# Altium schematic sheet AT91.SchDoc: Treetap 7C - Microprocessor
size A3; Author: Treetap Group; DrawnBy: Treetap Group; Revision: 1; SheetNumber: 2; SheetTotal: 7; PageSetup: Record=PageOptions|CenterHorizontal=True|CenterVertical=True|PrintScale=1.01|XCorrection=1.00|YCorrection=1.00|PrintKind=1|BorderSize=5000000|LeftOffset=0|BottomOffset=0|Orientation=2|PaperLength=1000|PaperWidth=1000|Scale=100|PaperSource=15|PrintQuality=600|MediaType=1|DitherType=10|PaperKind=A3|PrintScaleMode=1
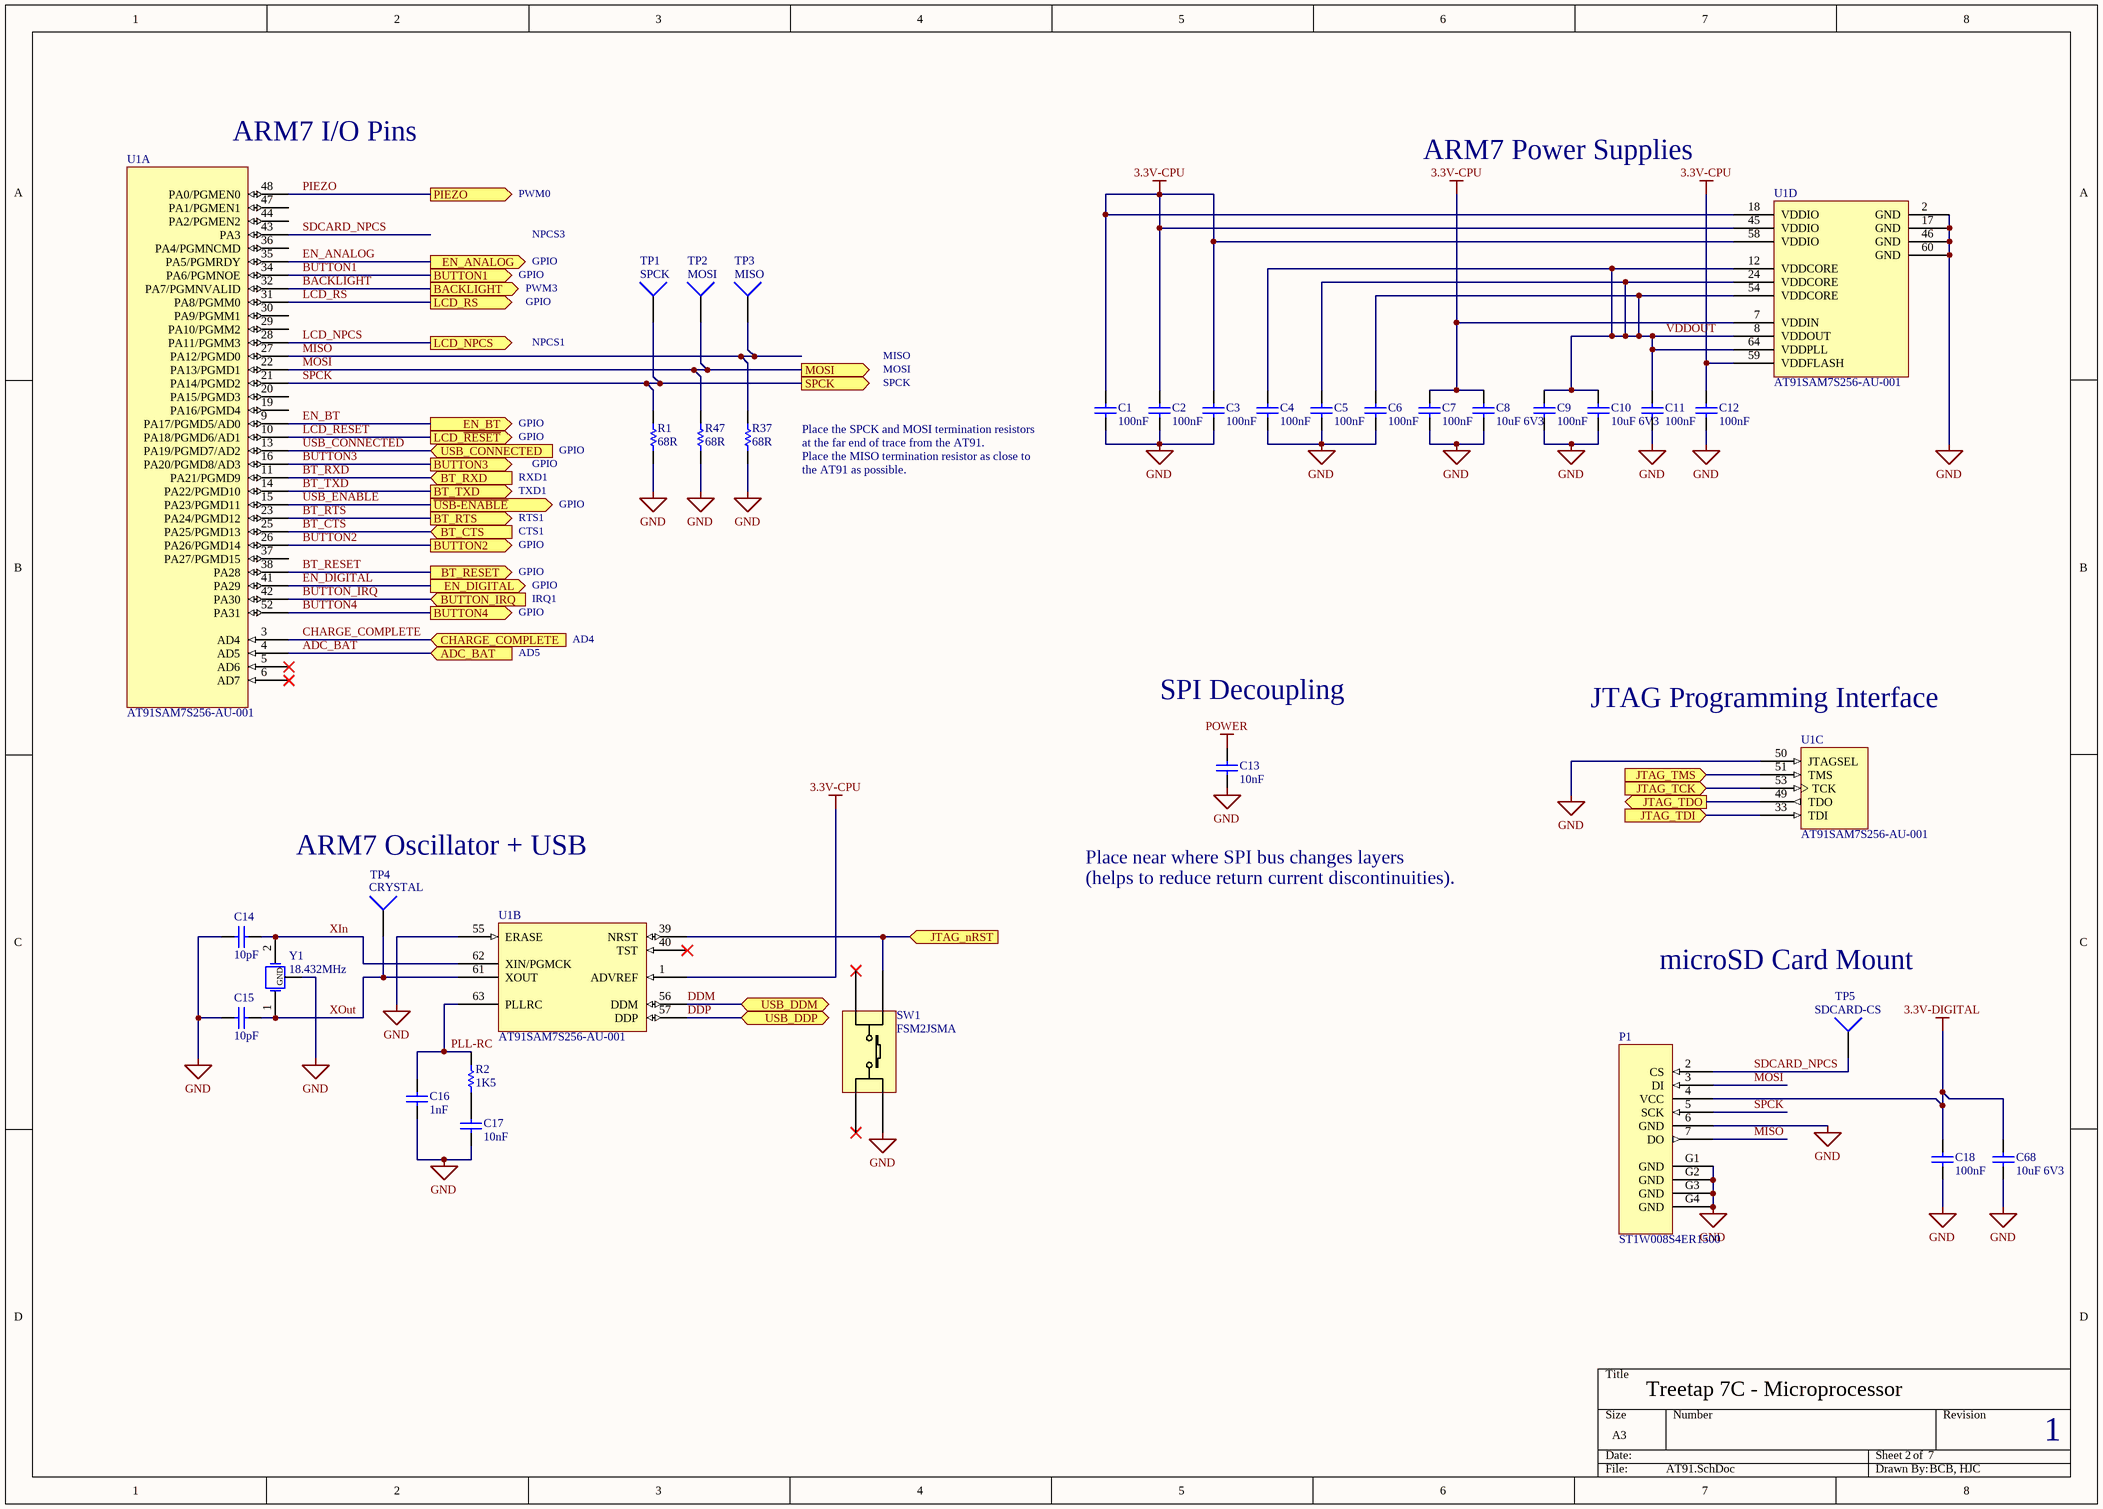
[diagram p0: AT91.SchDoc]

## Parts
C1  100nF  [CC0603]
C2  100nF  [CC0603]
C3  100nF  [CC0603]
C4  100nF  [CC0603]
C5  100nF  [CC0603]
C6  100nF  [CC0603]
C7  100nF  [CC0603]
C8  10uF 6V3  [CC0603]
C9  100nF  [CC0603]
C10  10uF 6V3  [CC0603]
C11  100nF  [CC0603]
C12  100nF  [CC0603]
C13  10nF  [CC0603]
C14  10pF  [CC0603]
C15  10pF  [CC0603]
C16  1nF  [CC0603]
C17  10nF  [CC0603]
C18  100nF  [CC0603]
C68  10uF 6V3  [CC0603]
P1  ST1W008S4ER1500  [ST1W008S4ER1500]
R1  68R  [R0603]
R2  1K5  [R0603]
R37  68R  [R0603]
R47  68R  [R0603]
SW1  FSM2JSMA  [FSM2JSMA]
TP1  SPCK  [SMTP_1]
TP2  MOSI  [SMTP_1]
TP3  MISO  [SMTP_1]
TP4  CRYSTAL  [SMTP_1]
TP5  SDCARD-CS  [SMTP_1]
U1  AT91SAM7S256-AU-001  [LQFP64_L]  (parts A,B,C,D of 4)
Y1  18.432MHz  [ABM10-18.432MHZ-E20-T]

## Ports
ADC_BAT (in), BACKLIGHT (out), BT_CTS (in), BT_RESET (out), BT_RTS (out), BT_RXD (in), BT_TXD (out), BUTTON1 (out), BUTTON2 (out), BUTTON3 (out), BUTTON4 (out), BUTTON_IRQ (in), CHARGE_COMPLETE (in), EN_ANALOG (out), EN_BT (out), EN_DIGITAL (out), JTAG_nRST (in), JTAG_TCK (in), JTAG_TDI (in), JTAG_TDO (out), JTAG_TMS (in), LCD_NPCS (out), LCD_RS (out), LCD_~{RESET} (out), MOSI (out), PIEZO (out), SPCK (out), USB_CONNECTED (in), USB_DDM (bidir), USB_DDP (bidir), ~{USB-ENABLE} (out)

## Nets
3.3V-CPU: C1.2 C2.2 C3.1 C7.1 C8.2 C12.2 U1.1(ADVREF) U1.7(VDDIN) U1.18(VDDIO) U1.45(VDDIO) U1.58(VDDIO) U1.59(VDDFLASH)
3.3V-DIGITAL: C18.2 C68.2 P1.4(VCC)
GND: C1.1 C2.1 C3.2 C4.1 C5.1 C6.1 C7.2 C8.1 C9.2 C10.1 C11.1 C12.1 C13.1 C14.2 C15.1 C16.1 C17.1 C18.1 C68.1 P1.6(GND) P1.G1(GND) P1.G2(GND) P1.G3(GND) P1.G4(GND) R1.1 R37.1 R47.1 SW1.4 U1.2(GND) U1.17(GND) U1.46(GND) U1.50(JTAGSEL) U1.55(ERASE) U1.60(GND) Y1.G(GND)
POWER: C13.2
ADC_BAT: U1.4(AD5) ; port ADC_BAT
BACKLIGHT: U1.32(PA7/PGMNVALID) ; port BACKLIGHT
BT_CTS: U1.25(PA25/PGMD13) ; port BT_CTS
BT_RESET: U1.38(PA28) ; port BT_RESET
BT_RTS: U1.23(PA24/PGMD12) ; port BT_RTS
BT_RXD: U1.11(PA21/PGMD9) ; port BT_RXD
BT_TXD: U1.14(PA22/PGMD10) ; port BT_TXD
BUTTON1: U1.34(PA6/PGMNOE) ; port BUTTON1
BUTTON2: U1.26(PA26/PGMD14) ; port BUTTON2
BUTTON3: U1.16(PA20/PGMD8/AD3) ; port BUTTON3
BUTTON4: U1.52(PA31) ; port BUTTON4
BUTTON_IRQ: U1.42(PA30) ; port BUTTON_IRQ
CHARGE_COMPLETE: U1.3(AD4) ; port CHARGE_COMPLETE
DDM: U1.56(DDM) ; port USB_DDM
DDP: U1.57(DDP) ; port USB_DDP
EN_ANALOG: U1.35(PA5/PGMRDY) ; port EN_ANALOG
EN_BT: U1.9(PA17/PGMD5/AD0) ; port EN_BT
EN_DIGITAL: U1.41(PA29) ; port EN_DIGITAL
JTAG_nRST: SW1.1 U1.39(NRST) ; port JTAG_nRST
JTAG_TCK: U1.53(TCK) ; port JTAG_TCK
JTAG_TDI: U1.33(TDI) ; port JTAG_TDI
JTAG_TDO: U1.49(TDO) ; port JTAG_TDO
JTAG_TMS: U1.51(TMS) ; port JTAG_TMS
LCD_NPCS: U1.28(PA11/PGMM3) ; port LCD_NPCS
LCD_RESET: U1.10(PA18/PGMD6/AD1) ; port LCD_~{RESET}
LCD_RS: U1.31(PA8/PGMM0) ; port LCD_RS
MISO: P1.7(DO) R37.2 TP3.1 U1.27(PA12/PGMD0)
MOSI: P1.3(DI) R47.2 TP2.1 U1.22(PA13/PGMD1) ; port MOSI
PIEZO: U1.48(PA0/PGMEN0) ; port PIEZO
PLL-RC: C16.2 R2.2 U1.63(PLLRC)
SDCARD_NPCS: P1.2(CS) TP5.1 U1.43(PA3)
SPCK: P1.5(SCK) R1.2 TP1.1 U1.21(PA14/PGMD2) ; port SPCK
USB_CONNECTED: U1.13(PA19/PGMD7/AD2) ; port USB_CONNECTED
USB_ENABLE: U1.15(PA23/PGMD11) ; port ~{USB-ENABLE}
VDDOUT: C4.2 C5.2 C6.2 C9.1 C10.2 C11.2 U1.8(VDDOUT) U1.12(VDDCORE) U1.24(VDDCORE) U1.54(VDDCORE) U1.64(VDDPLL)
XIn: C14.1 U1.62(XIN/PGMCK) Y1.2(OSC2)
XOut: C15.2 TP4.1 U1.61(XOUT) Y1.1(OSC1)
NetC17_2: C17.2 R2.1

Not connected (* = marked no-connect by the designer): SW1 2* 3*; U1 5(AD6)* 6(AD7)* 19(PA16/PGMD4) 20(PA15/PGMD3) 29(PA10/PGMM2) 30(PA9/PGMM1) 36(PA4/PGMNCMD) 37(PA27/PGMD15) 40(TST)* 44(PA2/PGMEN2) 47(PA1/PGMEN1)

## Notes on the sheet
- (near U1) ARM7 I/O Pins
- ARM7 Power Supplies
- PWM0
- NPCS3
- GPIO
- PWM3
- NPCS1
- MISO
- MOSI
- (near C1) Place the SPCK and MOSI termination resistors
- at the far end of trace from the AT91.
- SPCK
- RXD1
- TXD1
- Place the MISO termination resistor as close to
- the AT91 as possible.
- CTS1
- RTS1
- IRQ1
- AD4
- AD5
- SPI Decoupling
- (near U1) JTAG Programming Interface
- ARM7 Oscillator + USB
- Place near where SPI bus changes layers
- (helps to reduce return current discontinuities).
- microSD Card Mount
- Treetap 7C - Microprocessor
- 2
- 7
- 1
- BCB, HJC

## Library data of the parts
C1-C7 C9 C11 C12 C18 = 100nF_CC0603: 0603 Capacitor; Supplier_Component_Code: RC-P100; published: 28/03/2007 10:54:57 a.m.; Supplier_Name: Soanar Plus; price: 0.09; value: 100nF; Part Number: 100nF_CC0603; Component Kind: Standard; Component Type: Standard; Designator: 100nF_CC0603; Pin Count: 2
C8 C10 C68 = 10uF_CC0603_6V3: 10uF 6.3V 0603 ceramic capacitor; Manufacturer: Multicomp; Part Number: MCCA000517; Supplier_Component_Code: 1759393; published: 8/06/2010; Supplier_Name: Farnell; price: 0.218; value: 10uF 6V3
C13 C17 = 10nF_CC0603: 0603 Capacitor; Supplier_Component_Code: RC-P097; published: 28/03/2007 10:54:57 a.m.; Supplier_Name: Soanar Plus; price: 0.09; value: 10nF; Part Number: 10nF_CC0603; Component Kind: Standard; Component Type: Standard; Designator: 10nF_CC0603; Pin Count: 2
C14 C15 = 10pF_CC0603: 0603 Capacitor; Supplier_Component_Code: RC-P050; published: 28/03/2007 10:54:57 a.m.; Supplier_Name: Soanar Plus; price: 0.06; value: 10pF; Part Number: 10pF_CC0603; Component Kind: Standard; Component Type: Standard; Designator: 10pF_CC0603; Pin Count: 2
C16 = 1nF_CC0603: 0603 Capacitor; Supplier_Component_Code: RC-P062; published: 28/03/2007 10:54:57 a.m.; Supplier_Name: Soanar Plus; price: 0.09; value: 1nF; Part Number: 1nF_CC0603; Component Kind: Standard; Component Type: Standard; Designator: 1nF_CC0603; Pin Count: 2
P1 = ST1W008S4ER1500: microSD mount; Manufacturer: JAE; Order multiple: 1; Supplier_Name: Farnell; Supplier_Component_Code: 1702072; price: 4.55; value: ST1W008S4ER1500; Part Number: ST1W008S4ER1500; Pack of: 1
R1 R37 R47 = 68R_R0603: 0603 Resistor; ECE_Component_Code: 68R_R0603; value: 68R; Supplier_Component_Code: RS-S045; published: 12/03/2007 11:34:34 a.m.; Supplier_Name: Soanar Plus; price: 0.08; Part Number: 68R_R0603; Component Kind: Standard; Component Type: Standard; Designator: 68R_R0603; Pin Count: 2
R2 = 1K5_R0603: 0603 Resistor; ECE_Component_Code: 1K5_R0603; value: 1K5; Supplier_Component_Code: RS-S077; published: 12/03/2007 11:34:34 a.m.; Supplier_Name: Soanar Plus; price: 0.08; Part Number: 1K5_R0603; Component Kind: Standard; Component Type: Standard; Designator: 1K5_R0603; Pin Count: 2
SW1 = FSM2JSMA: DPST SMD Switch; Manufacturer: Tyco Electronics; Pack of: 1; Supplier_Name: Farnell; Supplier_Component_Code: 3801287; price: 0.516; Part Number: FSM2JSMA; Order multiple: 1; value: FSM2JSMA
TP1-TP5 = SMTestPoint: Test point hook (surface mount); Manufacturer: Harwin; Part Number: S1751-46; Order Multiple: 1; Pack of: 100; price: 40.01; published: 15/02/2010; Supplier_Name: Farnell; Supplier_Component_Code: 1022338; value: SMTestPoint
U1 = AT91SAM7S256-AU-001: Smart ARM Microcontroller, ARM7TDMI 32-Bit RISC CPU, 256KB Flash and 64KB SRAM, 64-Pin LQFP, Industrial, Pb-Free; Manufacturer: Atmel; Pack of: 1; ComponentLink1Description: Manufacturer Link; ComponentLink1URL: http://www.atmel.com; ComponentLink2Description: Datasheet; ComponentLink2URL: http://www.atmel.com/dyn/resources/prod_documents/6175s.pdf; price: 18.69; published: 15/02/2010; Supplier_Name: Farnell; Supplier_Component_Code: 1095460; value: AT91SAM7S256-AU-001; Part Number: AT91SAM7S256; Order multiple: 1
Y1 = ABM10-18.432MHZ-E20-T: 18.432MHz SMT crystal 2x2.5mm 20ppm; Manufacturer: Abracon Corporation; Pack of: 1; Part Number: ABM10-18.432MHZ-E20-T; Supplier_Component_Code: 535-9813-1-ND; published: 03/06/2010; Supplier_Name: Digikey; price: 3.79; Order multiple: 1; value: 18.432MHz